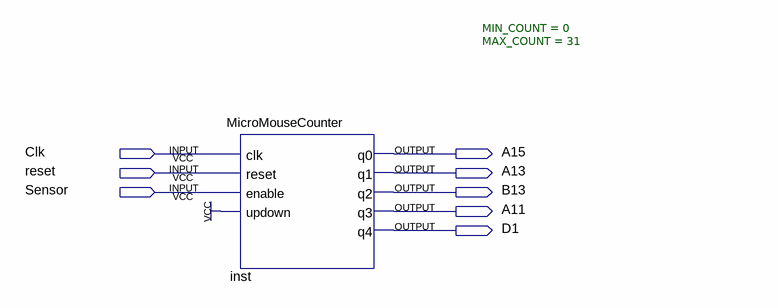
[diagram p0: schematic sheet]
// Quartus schematic Contador.bdf as structural Verilog: 1 symbols, 8 pins
module Contador (
  input  Clk,
  input  reset,
  input  Sensor,
  output A15,
  output A13,
  output B13,
  output A11,
  output D1
);

  MicroMouseCounter #(.MIN_COUNT(0), .MAX_COUNT(31)) inst (
    .clk(Clk), .reset(reset), .enable(Sensor), .updown(1'b1), .q0(A15), .q1(A13), .q2(B13), .q3(A11), .q4(D1));
endmodule
